# EAGLE design Martensino_1.0v (EAGLE 7.5.0)
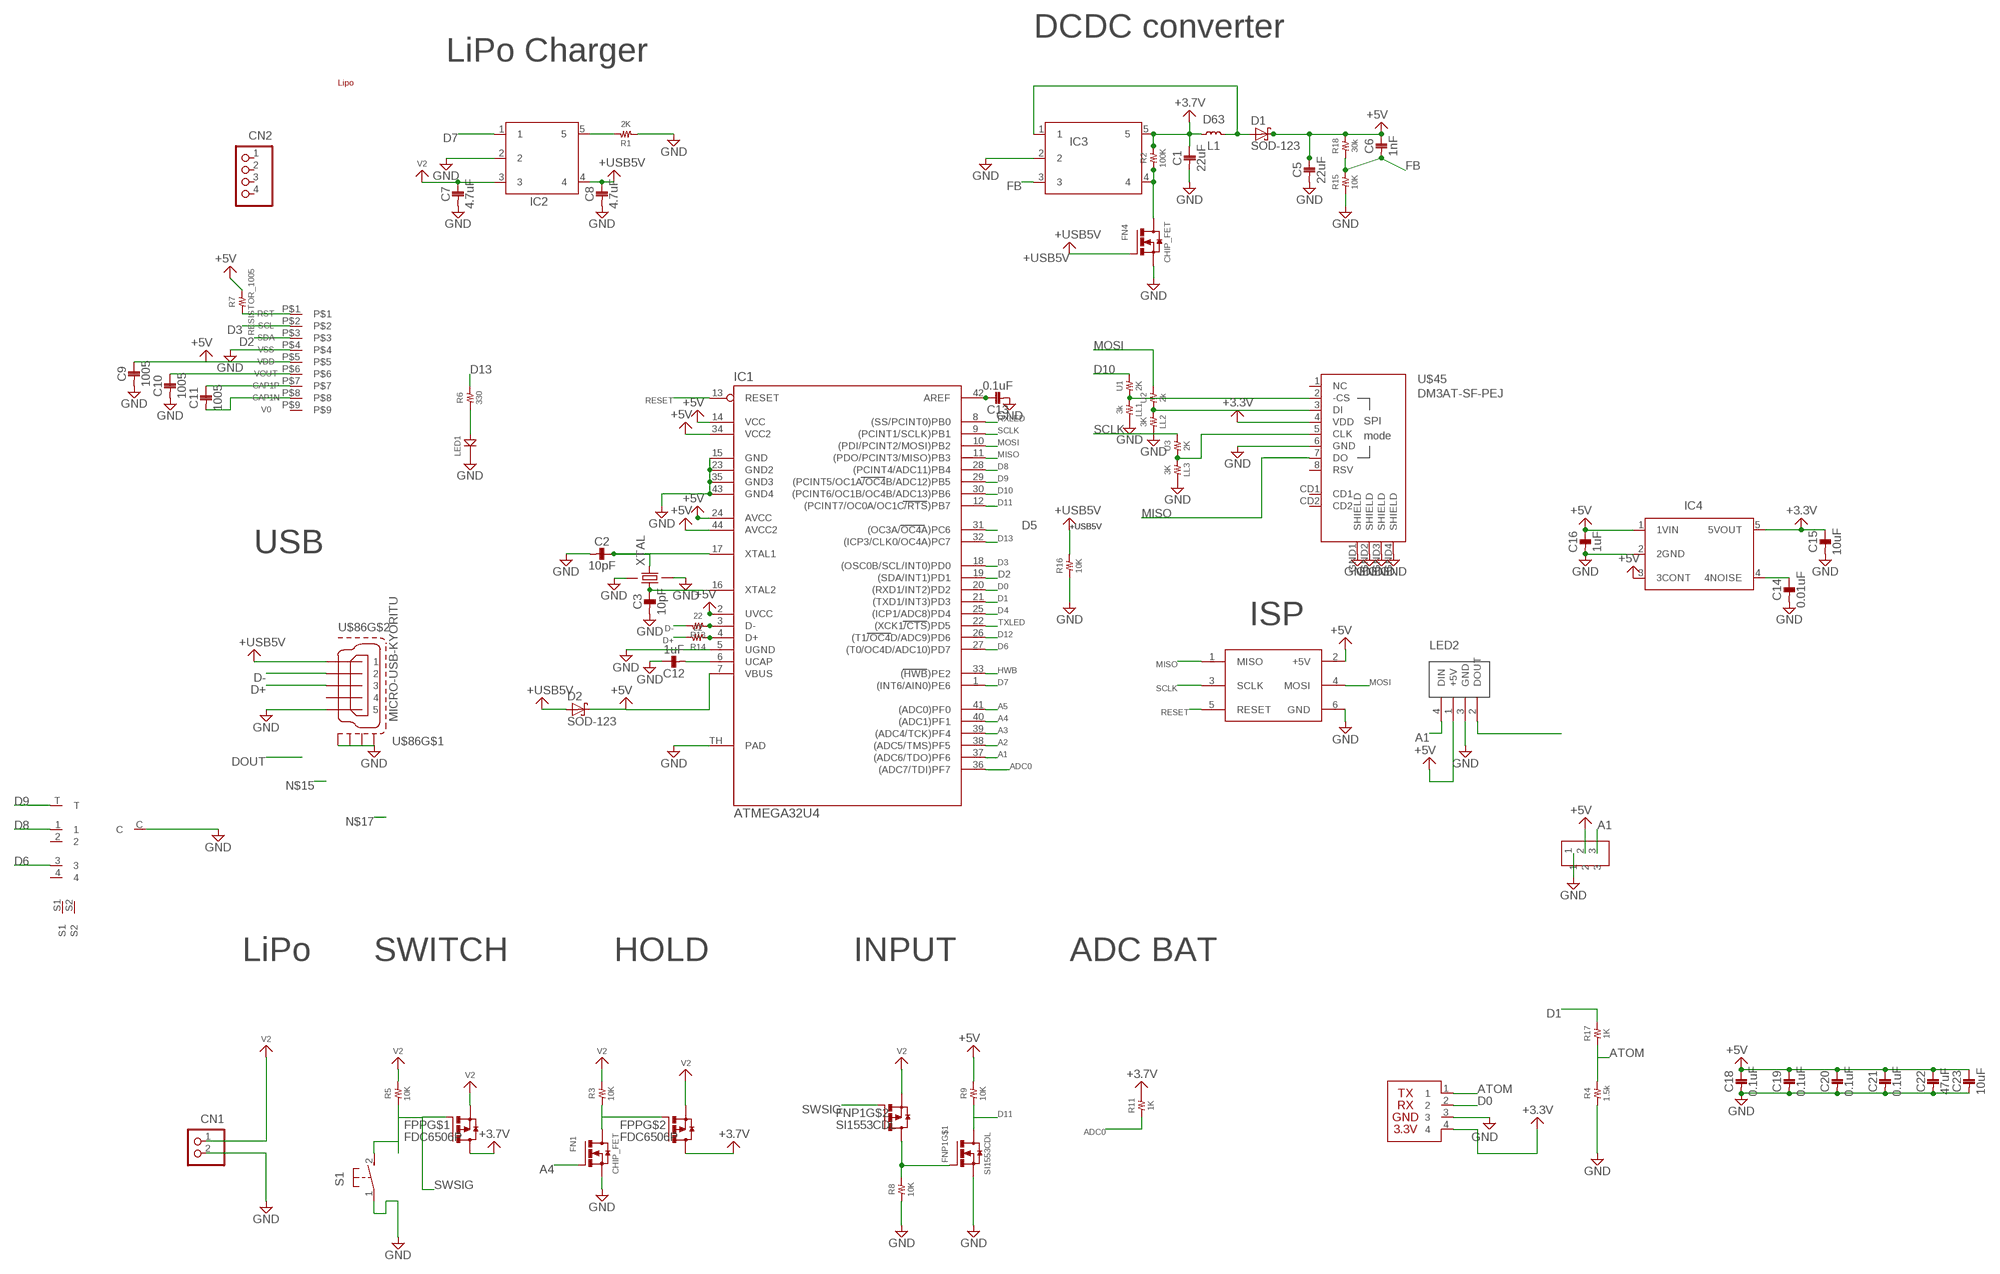
[diagram p0: schematic, sheet 1]

## Parts
BLE  BLE_SERIAL2_NO_HOLE  [BLESERIAL2_NO_HOLE]
C1  22uF  1608  [1608]
C2  10pF  1005  [1005]
C3  10pF  1005  [1005]
C5  22uF  1608  [1608]
C6  1nF  1005  [1005]
C7  4.7uF  1005  [1005]
C8  4.7uF  1005  [1005]
C9  1005  [1005]
C10  1005  [1005]
C11  1005  [1005]
C12  1uF  1005  [1005]
C13  0.1uF  1005  [1005]
C14  0.01uF  1608  [1608]
C15  10uF  1608  [1608]
C16  1uF  1005  [1005]
C18  0.1uF  1005  [1005]
C19  0.1uF  1005  [1005]
C20  0.1uF  1005  [1005]
C21  0.1uF  1005  [1005]
C22  47uF  1608  [1608]
C23  10uF  1608  [1608]
CN1  S2B-PH-K-S  [S2B-PH-K-S]
CN2  S4B-PH-K-S  [S4B-PH-K-S]
D1  SOD-123  [SOD_123]
D2  SOD-123  [SOD_123]
FN1  CHIP_FET  [SOT23]
FN4  CHIP_FET  [SOT23]
FNP1  SI1553CDL  [SOT363]
FPP  FDC6506P  [SOT23-6]
IC1  ATMEGA32U4  [QFN-44-7X7]
IC2  MCP73831  [SOT23-5L]
IC3  LM2735  [SOT23-5L]
IC4  TAR5SB  [SSOP5-P-0.95]
L1  D63  [TOKO]
LED1  CHIPLED  [1608]
LED2  NEO_FLAT  [NEO_FLAT]
LL1  3k  RESISTOR_1005  [1005]
LL2  3K  RESISTOR_1005  [1005]
LL3  3K  RESISTOR_1005  [1005]
R1  2K  RESISTOR_1005  [1005]
R2  100K  RESISTOR_1005  [1005]
R3  10K  RESISTOR_1005  [1005]
R4  1.5k  RESISTOR_1005  [1005]
R5  10K  RESISTOR_1005  [1005]
R6  330  RESISTOR_1005  [1005]
R7  RESISTOR_1005  [1005]
R8  10K  RESISTOR_1005  [1005]
R9  10K  RESISTOR_1005  [1005]
R11  1K  RESISTOR_1005  [1005]
R13  22  RESISTOR_1005  [1005]
R14  22  RESISTOR_1005  [1005]
R15  10K  RESISTOR_1005  [1005]
R16  10K  RESISTOR_1005  [1005]
R17  1K  RESISTOR_1005  [1005]
R18  30k  RESISTOR_1005  [1005]
S1  31-XX  [B3F-31XX]
U1  2K  RESISTOR_SMD_1005  [1005]
U2  2k  RESISTOR_SMD_1005  [1005]
U3  2K  RESISTOR_SMD_1005  [1005]
U$3  ICSP  [ICSP]
U$8  LIPO400MAH  [LIPO400MAH]
U$30  3PIN_HALF  [3PIN_INT_HALF]
U$45  DM3AT-SF-PEJ  [DM3AT-SF-PEJ]
U$68  LCD_I2C_AQM  [AQM1602]
U$86  MICRO-USB-KYORITU  [ZX62R-B-5P]
U$90  TMHU28  [TMHU28]
XTAL  FA-238  [FA-238]

## Nets
+3.3V: BLE.4 C15.P$1 IC4.5(5VOUT) U$45.4(VDD)
+3.7V: C1.P$1 FPP.4(D) FPP.6(D) IC3.5 L1.1 R2.2 R11.2
+5V: C5.P$1 C6.1 C9.1 C16.1 C18.1 C19.1 C20.1 C21.1 C22.P$1 C23.P$1 D1.C D2.C IC1.2(UVCC) IC1.7(VBUS) IC1.14(VCC) IC1.24(AVCC) IC1.34(VCC2) IC1.44(AVCC2) IC4.1(1VIN) IC4.3(3CONT) LED2.1(+5V) R7.2 R9.2 R18.2 U$3.2(+5V) U$30.2 U$68.P$5
+USB5V: C8.1 D2.A FN4.1(G) IC2.4 R16.2 U$86.5
A1: IC1.37((ADC6/TDO)PF6) LED2.4(DIN) U$30.3
A2: IC1.38((ADC5/TMS)PF5)
A3: IC1.39((ADC4/TCK)PF4)
A4: FN1.1(G) IC1.40((ADC1)PF1)
A5: IC1.41((ADC0)PF0)
ADC0: IC1.36((ADC7/TDI)PF7) R11.1
ATOM: BLE.1 R4.2 R17.1
D0: BLE.2 IC1.20((RXD1/INT2)PD2)
D1: IC1.21((TXD1/INT3)PD3) R17.2
D2: IC1.19((SDA/INT1)PD1) U$68.P$3
D3: IC1.18((OSC0B/SCL/INT0)PD0) U$68.P$2
D4: IC1.25((ICP1/ADC8)PD4)
D5: IC1.31((OC3A/OC4A)PC6)
D6: IC1.27((T0/OC4D/ADC10)PD7) U$90.3
D7: IC1.1((INT6/AIN0)PE6) IC2.1
D8: IC1.28((PCINT4/ADC11)PB4) U$90.1
D9: IC1.29((PCINT5/OC1A/OC4B/ADC12)PB5) U$90.T
D10: IC1.30((PCINT6/OC1B/OC4B/ADC13)PB6) U1.2
D11: FNP1.6(D) IC1.12((PCINT7/OC0A/OC1C/RTS)PB7) R9.1
D12: IC1.26((T1/OC4D/ADC9)PD6)
D13: IC1.32((ICP3/CLK0/OC4A)PC7) R6.2
D+: R14.2 U$86.3
D-: R13.2 U$86.4
DL: D1.A IC3.1 L1.2
DOUT: LED2.2(DOUT)
FB: C6.2 IC3.3 R15.2 R18.1
GND: BLE.3 C1.P$2 C2.2 C3.2 C5.P$2 C7.2 C8.2 C9.2 C10.2 C12.1 C13.2 C14.P$2 C15.P$2 C16.2 C18.2 C19.2 C20.2 C21.2 C22.P$2 C23.P$2 CN1.2 FN1.2(S) FN4.2(S) FNP1.1(S) IC1.5(UGND) IC1.15(GND) IC1.23(GND2) IC1.35(GND3) IC1.43(GND4) IC1.TH(PAD) IC2.2 IC3.2 IC4.2(2GND) LED1.2(K) LED2.3(GND) LL1.2 LL2.2 LL3.2 R1.1 R4.1 R8.1 R15.1 R16.1 S1.1(P) U$3.6(GND) U$30.1 U$45.6(GND) U$45.GND1(SHIELD) U$45.GND2(SHIELD) U$45.GND3(SHIELD) U$45.GND4(SHIELD) U$68.P$4 U$86.1 U$86.M1(S1) U$86.M2(S2) U$86.M3(S3) U$86.M4(S4) U$90.C XTAL.2 XTAL.4
HWB: IC1.33((HWB)PE2)
MISO: IC1.11((PDO/PCINT3/MISO)PB3) U$3.1(MISO) U$45.7(DO)
MOSI: IC1.10((PDI/PCINT2/MOSI)PB2) U2.2 U$3.4(MOSI)
N$1: LED1.1(A) R6.1
N$2: IC2.5 R1.2
N$3: FN4.3(D) IC3.4 R2.1
N$4: R7.1 U$68.P$1
N$5: LL3.1 U3.1 U$45.5(CLK)
N$6: FN1.3(D) FPP.3(G) R3.1
N$7: C3.1 IC1.16(XTAL2) XTAL.1
N$8: IC1.3(D-) R13.1
N$9: C13.1 IC1.42(AREF)
N$10: C2.1 IC1.17(XTAL1) XTAL.3
N$11: LL2.1 U2.1 U$45.3(DI)
N$12: LL1.1 U1.1 U$45.2(-CS)
N$13: C12.2 IC1.6(UCAP)
N$14: IC1.4(D+) R14.1
N$16: C14.P$1 IC4.4(4NOISE)
N$19: C10.1 U$68.P$6
N$20: C11.1 U$68.P$7
N$21: C11.2 U$68.P$8
RESET: IC1.13(RESET) U$3.5(RESET)
RXLED: IC1.8((SS/PCINT0)PB0)
SCLK: IC1.9((PCINT1/SCLK)PB1) U3.2 U$3.3(SCLK)
SIG: FNP1.2(G) FNP1.3(D) R8.2
SWSIG: FNP1.5(G) FPP.1(G) R5.1 S1.2(S)
TXLED: IC1.22((XCK1/CTS)PD5)
V2: C7.1 CN1.1 FNP1.4(S) FPP.2(S) FPP.5(S) IC2.3 R3.2 R5.2
Unconnected: CN2.1 CN2.2 CN2.3 CN2.4 U$45.1(NC) U$45.8(RSV) U$45.CD1 U$45.CD2 U$68.P$9 U$86.2 U$90.2 U$90.4 U$90.S1 U$90.S2

## Notes on the sheet
- DCDC converter
- LiPo Charger
- D5
- USB
- ISP
- LiPo | SWITCH | HOLD | INPUT | ADC BAT

## Library data of the parts
BLE = 12_module:BLE_SERIAL2_NO_HOLE
C1 C5 C14 C15 C22 C23 = 02_C:1608
C2 C3 C6-C13 C16 C18-C21 = 02_C:1005
CN1 = jst-ph1:S2B-PH-*: Wire-to-Board 2.0mm pitch side mount connector Source: http://www.jst-mfg.com/product/pdf/jpn/PH.pdf http://www.jst-mfg.com/product/detail.php?series=199
CN2 = jst-ph1:S4B-PH-*: Wire-to-Board 2.0mm pitch side mount connector Source: http://www.jst-mfg.com/product/pdf/jpn/PH.pdf http://www.jst-mfg.com/product/detail.php?series=199
D1 D2 = 15_DIODE:SOD-123
FN1 FN4 = 06_FET:CHIP_FET
FNP1 = 06_FET:SI1553CDL
FPP = 06_FET:FDC6506P
IC1 = 04_IC:ATMEGA32U4
IC2 = 04_IC:MCP73831
IC3 = 04_IC:LM2735
IC4 = 04_IC:TAR5SB
L1 = 03_L:D63
LED1 = 10_LED:CHIPLED
LED2 = 10_LED:NEO_FLAT
LL1-LL3 R1-R9 R11 R13-R18 = 01_R:RESISTOR_1005
S1 = 09_1_switch:31-XX: OMRON SWITCH
U1-U3 = 01_R:RESISTOR_SMD_1005
U$3 = 08_CONECTOR:ICSP
U$8 = 16_battery:LIPO400MAH
U$30 = 08_CONECTOR:3PIN_HALF
U$45 = sd-card:DM3AT-SF-PEJ: HIROSE microSD socket DM3AT-SF-PEJ
U$68 = 12_module:LCD_I2C_AQM
U$86 = con-hirose1:MICRO-USB-KYORITU
U$90 = 09_1_switch:TMHU28
XTAL = 09_2_CRYSTAL:FA-238

## Net classes
1 POWER: width 0.5 mm, clearance 0.5 mm

## Board
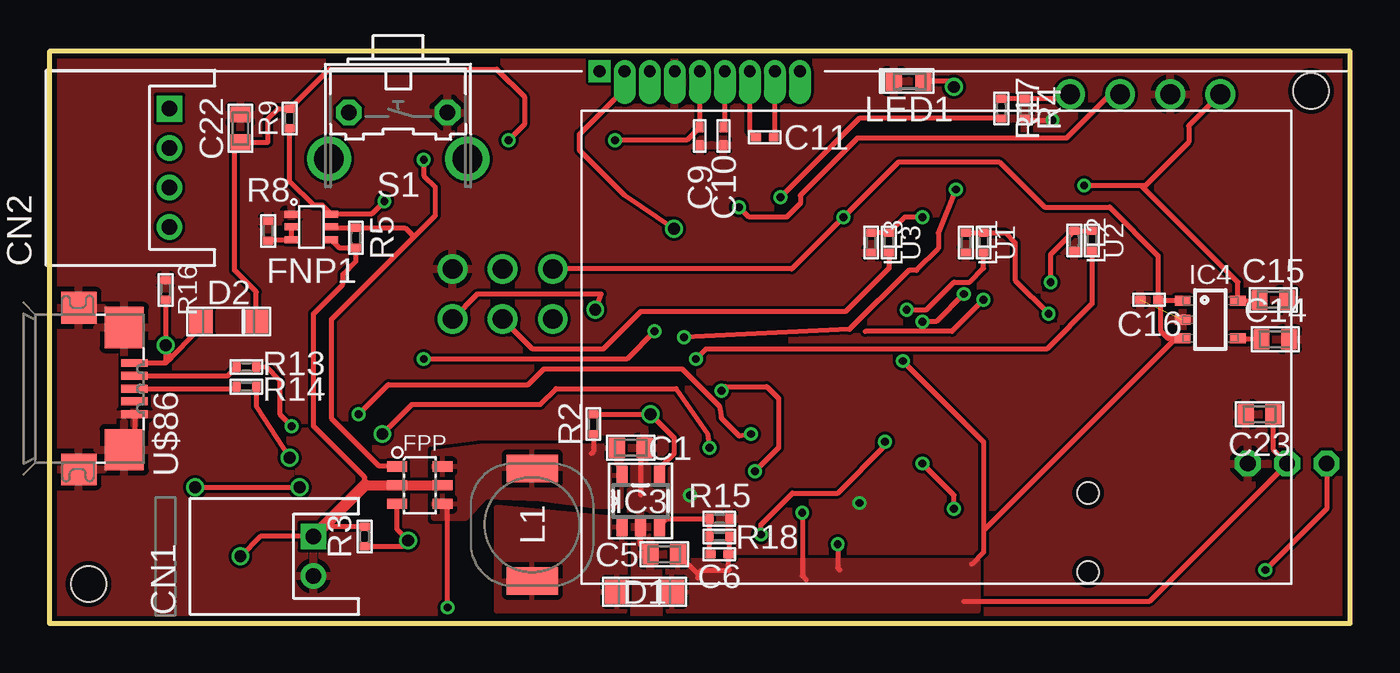
[diagram p1: board, top side]
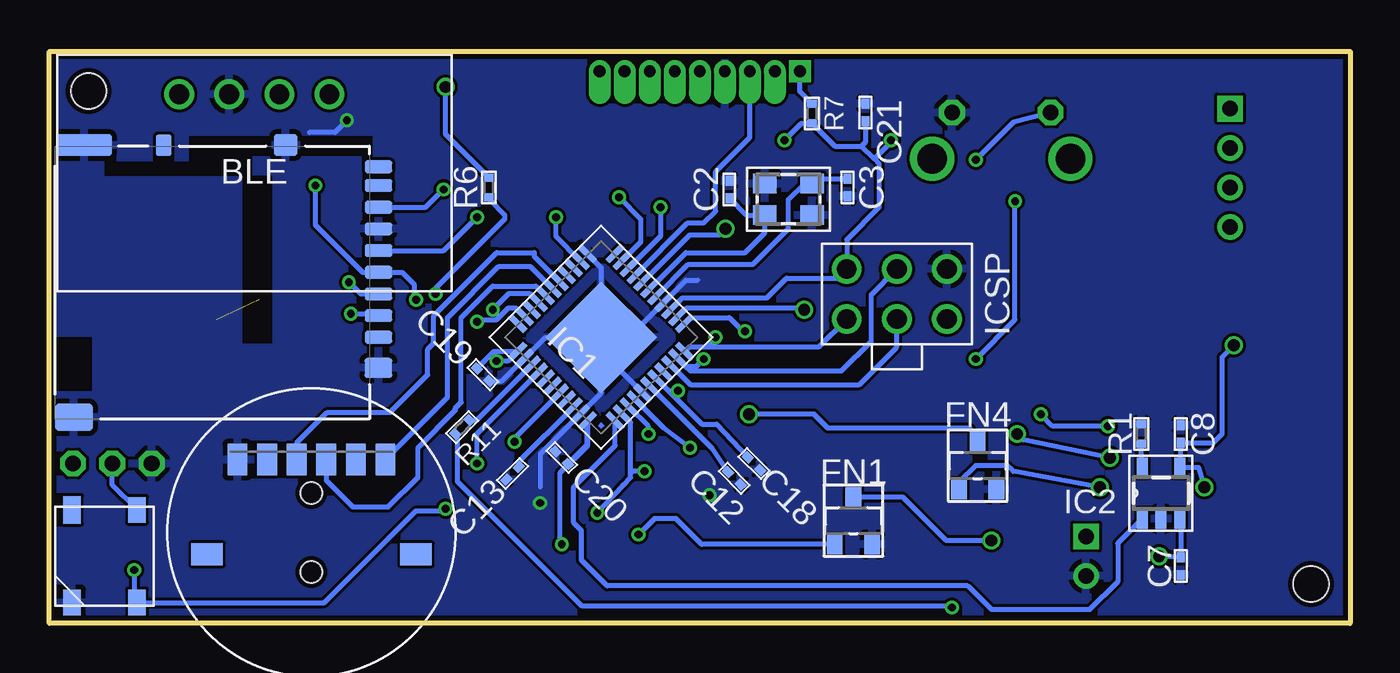
[diagram p2: board, bottom side, seen from below]

Size 66 x 29 mm. Coordinates in mm from the lower left corner, seen from the top.
Outline: 0,0 66,0 66,29 0,29 0,0
Copper layers (1*16): Top 0.035mm / dielectric 1.5mm / Bottom 0.035mm
Design rules "SeeedStudio_2layer_DRU_no_angle_20140221": minimum track width 6mil, minimum drill 12mil, track to track 6mil, track to pad 6mil, pad to pad 6mil, via to via 6mil, smd to smd 0mil, copper to edge 10mil, drill to drill 10mil, minimum pad ring 10mil, minimum via ring 6mil, stop-mask expansion 2mil, vias tented up to drill 100mil, thermal gap 10mil
Holes 1.8 mm at 2,2 64,27
bKeepout: area 62.5,25.5 to 65.5,28.5; area 0.5,0.5 to 3.5,3.5

### Footprints (pad centres in the part's own frame; a part is rotated, then mirrored left to right if it is on the bottom)
BLESERIAL2_NO_HOLE = drill 1: 1 -3.81,-2.73; 2 -1.27,-2.73; 3 1.27,-2.73; 4 3.81,-2.73
1608 = smd 0.8 x 1: P$1 -0.7,0; P$2 0.7,0
1005 = smd 0.5 x 0.4: 1 -0.45,0; 2 0.45,0
S2B-PH-K-S = drill 0.8 square: 1 1,0 | drill 0.8: 2 -1,0
S4B-PH-K-S = drill 0.8 square: 1 3,0 | drill 0.8: 2 1,0; 3 -1,0; 4 -3,0
SOD_123 = smd 1.2 x 1.2: A -1.4,0; C 1.4,0
SOT23 = smd 0.8 x 1: 1 -0.95,-1.2; 2 0.95,-1.2; 3 0,1.2
SOT363 = smd 0.35 x 0.7: 1 -0.65,-1; 2 0,-1; 3 0.65,-1; 4 0.65,1; 5 0,1; 6 -0.65,1
SOT23-6 = smd 0.508 x 1.016: 1 -0.95,-1.143; 2 0,-1.143; 3 0.95,-1.143; 4 0.95,1.143; 5 0,1.143; 6 -0.95,1.143
QFN-44-7X7 = smd 1.1 x 0.3: 1 -3.5,2.5; 2 -3.5,2; 3 -3.5,1.5; 4 -3.5,1; 5 -3.5,0.5; 6 -3.5,0; 7 -3.5,-0.5; 8 -3.5,-1; 9 -3.5,-1.5; 10 -3.5,-2; 11 -3.5,-2.5; 23 3.5,-2.5; 24 3.5,-2; 25 3.5,-1.5; 26 3.5,-1; 27 3.5,-0.5; 28 3.5,0; 29 3.5,0.5; 30 3.5,1; 31 3.5,1.5; 32 3.5,2; 33 3.5,2.5 | smd 0.3 x 1.1: 12 -2.5,-3.5; 13 -2,-3.5; 14 -1.5,-3.5; 15 -1,-3.5; 16 -0.5,-3.5; 17 0,-3.5; 18 0.5,-3.5; 19 1,-3.5; 20 1.5,-3.5; 21 2,-3.5; 22 2.5,-3.5; 34 2.5,3.5; 35 2,3.5; 36 1.5,3.5; 37 1,3.5; 38 0.5,3.5; 39 0,3.5; 40 -0.5,3.5; 41 -1,3.5; 42 -1.5,3.5; 43 -2,3.5; 44 -2.5,3.5 | smd 4 x 4: TH 0,0
SOT23-5L = smd 0.55 x 1: 1 -0.95,-1.3; 2 0,-1.3; 3 0.95,-1.3; 4 0.95,1.3; 5 -0.95,1.3
SSOP5-P-0.95 = smd 0.5 x 0.8: 1 -0.95,-1.4; 2 0,-1.4; 3 0.95,-1.4; 4 0.95,1.4; 5 -0.95,1.4
TOKO = smd 1.4 x 2.6: 1 -2.85,0; 2 2.85,0
1608' = smd 0.8 x 1: 1 -0.75,0; 2 0.75,0
NEO_FLAT = smd 1.3 x 0.9: 1 -2.35,1.65; 3 2.35,-1.65; 4 2.35,1.65 | smd 1.4 x 0.9: 2 -2.35,-1.65
1005' = smd 0.4 x 0.5: 1 -0.5,0; 2 0.5,0
B3F-31XX = drill 0.8 octagon: 1 -2.5,-1.1; 2 2.5,-1.1 | drill 1.5 pad 2.159: 3 -3.505,1.245; 4 3.505,1.245
ICSP = drill 1 pad 1.5: 1 -1.27,2.54; 2 1.27,2.54; 3 -1.27,0; 4 1.27,0; 5 -1.27,-2.54; 6 1.27,-2.54
3PIN_INT_HALF = drill 0.8 octagon: 1 -2,0; 2 0,0; 3 2,0
DM3AT-SF-PEJ = smd 0.65 x 1.4: 1 3.2,16.4; 2 2.1,16.4; 3 1,16.4; 4 -0.1,16.4; 5 -1.2,16.4; 6 -2.3,16.4; 7 -3.4,16.4; 8 -4.5,16.4; CD1 -5.45,16.4 | smd 1.1 x 0.8: CD2 -6.55,5.5 | smd 1.1 x 2.8: GND1 -6.55,1.475 | smd 1.4 x 1.9: GND2 7.25,0.95 | smd 1 x 1.4: GND3 4.75,16.4 | smd 1.1 x 1.2: GND4 -6.55,11.7
AQM1602 = drill 0.6 pad 0.813 square: P$1 -5.08,0 | drill 0.6 pad 0.813 offset: P$2 -3.81,0; P$3 -2.54,0; P$4 -1.27,0; P$5 0,0; P$6 1.27,0; P$7 2.54,0; P$8 3.81,0; P$9 5.08,0
ZX62R-B-5P = smd 1.35 x 0.4: 1 2.875,-1.3; 2 2.875,-0.65; 3 2.875,0; 4 2.875,0.65; 5 2.875,1.3 | smd 1.8 x 1.6: M1 0.05,-4.1; M2 0.05,4.1 | smd 2 x 2.1: M3 2.35,3.1; M4 2.35,-3.1
TMHU28 = smd 1 x 1.6: 1 -3.75,-3.7; 2 -2.25,-3.7; 3 0.75,-3.7; 4 2.25,-3.7; C 3.75,-3.7; T -0.75,-3.7 | smd 1.6 x 1.1: S1 -5.3,1.1; S2 5.3,1.1 | hole 1.1: 0,-2; 0,2
FA-238 = smd 1.2 x 1: 1 -1.2,-0.8; 2 1.2,-0.8; 3 1.2,0.8; 4 -1.2,0.8

### Placement (x,y rotation side)
BLE  55.6,24.1 180 bottom
C1  29.5,8.9 0 top
C2  31.5,22 90 bottom
C3  25.5,22.1 270 bottom
C5  31.2,3.5 180 top
C6  34,3.5 180 top
C7  8.6,2.9 270 bottom
C8  8.6,9.6 90 bottom
C9  33,24.7 270 top
C10  34.2,24.7 270 top
C11  36.3,24.65 0 top
C12  31.25,7.35 135 bottom
C13  42.5,7.6 225 bottom
C14  62.2,14.4 0 top
C15  62.1,16.4 0 top
C16  55.8,16.4 180 top
C18  30.25,8.1 315 bottom
C19  44,12.6 315 bottom
C20  40,8.4 135 bottom
C21  24.6,25.9 90 bottom
C22  9.7,25.1 90 top
C23  61.4,10.6 180 top
CN1  13.4,3.4 90 top
CN2  6.1,23.1 90 top
D1  30.2,1.6 0 top
D2  9.1,15.3 0 top
FN1  25.2,5.2 0 bottom
FN4  18.9,8 0 bottom
FNP1  13.3,20.1 270 top
FPP  18.8,7 270 top
IC1  38,14.5 135 bottom
IC2  9.6,6.6 0 bottom
IC3  30,6.2 0 top
IC4  58.9,15.4 270 top
L1  24.5,5 270 top
LED1  CHIPLED  [1608']  43.6,27.5 180 top
LED2  63.2,3.4 270 bottom
LL1  3k  [1005']  46.5,19.3 270 top
LL2  3K  [1005']  52,19.4 270 top
LL3  3K  [1005']  41.7,19.3 270 top
R1  2K  [1005']  10.6,9.6 270 bottom
R2  100K  [1005']  27.6,10.1 270 top
R3  10K  [1005']  16,4.4 90 top
R4  1.5k  [1005']  49.5,26.1 90 top
R5  10K  [1005']  15.55,19.55 270 top
R6  330  [1005']  43.7,22.1 270 bottom
R7  RESISTOR_1005  [1005']  27.3,25.85 270 bottom
R8  10K  [1005']  11.1,19.9 270 top
R9  10K  [1005']  12.2,25.6 90 top
R11  1K  [1005']  45.05,9.95 225 bottom
R13  22  [1005']  10,13 180 top
R14  22  [1005']  10,12 180 top
R15  10K  [1005']  34,5.3 180 top
R16  10K  [1005']  5.9,16.9 270 top
R17  1K  [1005']  48.3,26.1 270 top
R18  30k  [1005']  34,4.4 0 top
S1  17.7,24.8 180 top
U1  2K  [1005']  47.4,19.3 270 top
U2  2k  [1005']  52.9,19.4 270 top
U3  2K  [1005']  42.6,19.3 270 top
U$3  23,16.7 90 bottom
U$8  27,2 0 top
U$30  62.8,8.1 0 top
U$45  65.7,17.7 270 bottom
U$68  33,28 0 top
U$86  1.45,11.9 0 top
U$90  52.7,4.6 180 bottom
XTAL  28.5,21.5 180 bottom

### Tracks (layer width: path | path; a pad name or v marks a point on that pad's centre or on a via)
+3.3V  (via drill 0.4)
  Top 0.25: BLE.4 57.8,25.22 57.8,24.4 55.6,22.2 55.4,22.2 | 55.4,22.2 v52.5,22.2 | v47.4,16.4 45.8,14.8 41.4,14.8 | C15.P$1 61.35,16.35 IC4.5 60.3,17.3 55.4,22.2
  Bottom 0.25: v52.5,22.2 52.5,20.2 50.1,17.8 U$45.4 48.1,17.8 47.5,17.2 47.5,16.5 v47.4,16.4
+3.7V  (via drill 0.4)
  Top 0.25: R2.2 27.6,8.7 27.5,8.6 | v20.2,0.8 20.2,5.79 FPP.4
  Bottom 0.25: R11.2 45.3,9.49 45.3,7.2 39,0.9 20.3,0.9 v20.2,0.8
  pour Top: 29,9 29,5.9 27.8,5.9 24.9,6.3 22.1,6.4 21.1,5.3 19.5,5.3 19.5,8.7 21.9,9
+5V  (via drill 0.4)
  Top 0.25: U$68.P$5 C9.1 32.35,24.5 v28.7,24.5 | D2.C 10.5,16.8 9.4,17.9 9.4,24.1 C22.P$1 11.1,24.4 11.1,25.6 11.6,26.1 R9.2 14.2,28.1 22.7,28.1 24.1,26.7 24.1,25.3 v23.3,24.5 | R18.2 34.5,3.55 C6.1 34.45,2.75 34.5,2.7 33.1,2.7 32.9,2.5 | C5.P$1 32.9,2.5 | 32.9,2.5 32.9,2.3 | v38.2,5.6 38.2,2.4 38.4,2.2 | C23.P$1 62.1,8.8 U$30.2 55.8,1.1 46.4,1.1 | U$3.2 37.67,17.97 v40.3,20.6 43.1,23.4 48.2,23.4 50.5,21.1 53.8,21.1 56.25,18.65 C16.1 | v43.3,13.3 47.4,9.2 47.4,4.7 | 47.4,4.7 47.4,3.6 46.8,3 | v40,4 40,2.8 40.1,2.7 | v34.1,11.8 34.3,12 36.4,12 37,11.4 37,8.9 v35.8,7.7 | IC4.1 56.3,16.35 C16.1 | C16.1 56.4,16.25 56.4,14.8 56.75,14.45 IC4.3 57.15,14.45 47.4,4.7
  Bottom 0.25: 24.8,24.2 26.15,24.2 R7.2 27.85,25.35 v28.7,24.5 | 24.8,24.2 24.15,23.55 | 24.15,23.55 23.9,23.3 23.9,21.1 25.54,19.46 U$3.2 26.01,17.5 28.6,17.5 29.6,16.5 33.88,16.5 IC1.14 | C18.1 32.15,10.1 32.89,10.1 IC1.7 34.59,11.8 v34.1,11.8 | C19.1 43.44,13.79 IC1.34 42.74,13.3 v43.3,13.3 | C21.1 24.6,24.4 24.8,24.2 | 36.5,7.6 36.5,7.4 36.9,7 v38.2,5.6 | 36.5,7.6 36.5,10.17 IC1.2 | C20.1 38.71,9.06 IC1.44 38.7,9 40.1,7.6 40.1,4.1 v40,4 | v23.3,24.5 23.3,24.4 24.15,23.55 | LED2.1 62.8,7 U$30.2 | IC1.24 40.3,19.63 v40.3,20.6 | v35.8,7.7 36.4,7.7 36.5,7.6
  pour Top: 31.4,0.6 31.4,3.2 47.1,3.2 47.1,0.6
+USB5V  (via drill 0.6)
  Top 0.25: U$86.5 5.8,13.2 | 5.8,13.2 5.9,13.2 6.2,13.5 | 6.2,13.5 7.4,14.7 7.4,15 D2.A | v5.9,14.1 5.9,13.3 5.8,13.2 | R16.2 5.9,13.8 6.2,13.5 | v7.4,6.9 v12.7,6.9
  Bottom 0.25: v5.9,14.1 6.5,13.5 6.5,9.6 6.95,9.15 C8.1 8.6,7.95 IC2.4 7.7,7.9 v7.4,6.9 | FN4.1 19.85,7.15 19,8 17.4,8 17.1,7.7 v12.7,6.9
A1  (via drill 0.4)
  Top 0.25: v45.9,5.8 45.9,6.5 v44.3,8.1 | U$30.3 64.8,5.8 v61.7,2.7
  Bottom 0.25: v45.9,5.8 46,5.7 47.4,5.7 52.05,1.05 LED2.4 61.7,1.2 v61.7,2.7 | v44.3,8.1 44.3,9.61 IC1.37
A4  (via drill 0.4)
  Top 0.25: v36.1,4.5 36.1,5 37.7,6.6 40,6.6 42.4,9 v42.4,9.2
  Bottom 0.25: FN1.1 32.9,4 34.2,5.3 35.3,5.3 v36.1,4.5 | v42.4,9.2 42.4,9.39 IC1.40
ADC0
  Bottom 0.25: R11.1 44.32,10.3 IC1.36
ATOM
  Top 0.25: BLE.1 51.56,26.6 R4.2 R17.1
D0  (via drill 0.4)
  Top 0.25: BLE.2 53.83,26.83 51.6,24.6 41,24.6 38.1,21.7 38.1,21.3 37.4,20.6 35.5,20.6 v35,21.1
  Bottom 0.25: v35,21.1 35,19.62 IC1.20
D1  (via drill 0.4)
  Top 0.25: R17.2 41.1,25.6 v37.1,21.6
  Bottom 0.25: v37.1,21.6 36,20.5 36,19.33 IC1.21
D2
  Bottom 0.25: U$68.P$3 30.46,24.64 32.2,22.9 32.2,20.9 32.8,20.3 33.61,20.3 IC1.19
D3  (via drill 0.6)
  Top 0.25: v31.7,20 29.19,21.71 26.9,24 26.9,24.8 29.19,27.09 U$68.P$2
  Bottom 0.25: IC1.18 33.51,19.7 32,19.7 v31.7,20
D6
  Bottom 0.25: U$90.3 53.45,9.15 51.9,10.7 48.7,10.7 46.8,12.6 46.8,13.9 46.5,14.2 46.5,15.6 43.3,18.8 41.4,18.8 41.4,18.61 IC1.27
D7
  Bottom 0.25: IC2.1 11.8,4.05 11.8,2.1 13.2,0.7 18.2,0.7 19.4,1.9 37.7,1.9 39,3.2 39,4.7 39.4,5.1 39.4,6.9 37.29,9.01 IC1.1
D8
  Bottom 0.25: U$90.1 45.8,11.45 45.8,15.5 43.2,18.1 41.6,18.1 IC1.28
D9
  Bottom 0.25: U$90.T 51.95,7.25 50.6,5.9 48.8,5.9 47.3,7.4 47.3,8.9 45.4,10.8 45.4,10.9 45.1,11.2 45.1,15.5 43.5,17.1 41.31,17.1 IC1.29
D10  (via drill 0.4)
  Top 0.25: v43.5,15.9 44.5,15.9 45.9,17.3 46.7,17.3 47.4,18 U1.2
  Bottom 0.25: IC1.30 41.61,16.7 42.7,16.7 v43.5,15.9
D11  (via drill 0.4)
  Top 0.25: R9.1 12.2,22.4 13.4,21.2 13.85,21.2 FNP1.6 16.35,20.75 v17,21.4 | v30.7,14.8 29.3,13.4 v19,13.4
  Bottom 0.25: IC1.12 33.46,15.5 31.5,15.5 30.8,14.8 v30.7,14.8 | v19,13.4 17,15.4 v17,21.4
D13  (via drill 0.4)
  Top 0.25: v46.4,16.7 45,15.3 v44.3,15.3
  Bottom 0.25: R6.2 43.7,21.5 42.9,20.7 42.9,20.5 46.4,17 v46.4,16.7 | v44.3,15.3 44.2,15.4 43.3,15.4 42.7,16 42.33,16 IC1.32
D+
  Top 0.25: U$86.3 9.4,11.9 R14.2
D-
  Top 0.25: U$86.4 9.05,12.55 R13.2
DL
  pour Top (rank 3): 22.7,0.6 22.7,5.9 29.2,5.3 29.2,0.6
FB
  Top 0.25: C6.2 33.5,3.55 R18.1 R15.2 31.35,5.3 IC3.3
GND  (via drill 0.4)  (1 unrouted)
  Top 0.25: U$86.1 4.33,9.32 U$86.M4 | C5.P$2 30,4 IC3.2 | C1.P$2 30,8.7 30,6.5 | R4.1 49.6,25.5 v50.9,25.5
  Bottom 0.25: IC1.TH 36.59,14.5 36.59,14.51 34.82,16.28 | IC1.5 38,13.79 IC1.TH | IC1.TH 38,11.67 IC1.43 41.1,8.57 41.1,6.9 | IC1.TH 40.83,14.5 IC1.35 43.05,12.28 C19.2 | IC1.23 38,18.04 IC1.TH | 33.1,17.4 33.7,17.4 34.82,16.28 | IC1.15 34.82,16.28 | v50.9,25.5 51.5,24.9 52.8,24.9
  other vias: 32.5,6.5 41.1,6.1
  pour Bottom (rank 6): -10,34 70,34 70,-5 -10,-5
  pour Top (rank 6): -10,30 70,30 70,-5 -10,-5
MISO  (via drill 0.4)
  Top 0.25: v46,22 45.1,19.8 45.1,19 44,17.9 43.6,17.9 40.6,14.9 v32.2,14.5
  Bottom 0.25: U$3.1 26.97,14 32.6,14 | 32.6,14 33.55,14 IC1.11 | v32.2,14.5 32.2,14.4 32.6,14 | U$45.7 46.9,21.1 v46,22
MOSI  (via drill 0.4)
  Top 0.25: v32.8,13.4 33.3,13.9 50.6,13.9 52.9,16.2 U2.2
  Bottom 0.25: IC1.10 33.69,13.01 | 33.69,13.01 33.47,12.8 25.8,12.8 24.3,14.3 24.3,16.67 U$3.4 | v32.8,13.4 33.19,13.01 33.69,13.01
N$1  (via drill 0.6)
  Top 0.25: v45.9,27.2 45.6,27.5 LED1.1
  Bottom 0.25: R6.1 45.9,24.8 v45.9,27.2
N$2
  Bottom 0.25: IC2.5 10.6,7.95 R1.2
N$3  (via drill 0.6)
  Top 0.25: IC3.4 30.95,7.85 31.7,8.6 31.7,9.4 v30.5,10.6 R2.1
  Bottom 0.25: FN4.3 19.3,9.9 26.5,9.9 27.2,10.6 v30.5,10.6
N$4
  Bottom 0.25: R7.1 27.92,26.97 U$68.P$1
N$5  (via drill 0.4)
  Top 0.25: v44.3,20.6 43.4,20.6 U3.1 LL3.1
  Bottom 0.25: v44.3,20.6 46,18.9 U$45.5
N$6  (via drill 0.6)
  Top 0.25: FPP.3 17.66,4.74 v18.2,4.2 17.9,3.9 R3.1
  Bottom 0.25: v18.2,4.2 20.5,4.2 22.7,6.4 FN1.3
N$7
  Bottom 0.25: C3.1 27.05,22.55 XTAL.1 27.7,22.3 28.5,21.5 28.5,20 30.3,18.2 33.59,18.2 IC1.16
N$8  (via drill 0.4)
  Top 0.25: R13.1 11,13 11.7,12.3 11.7,10.6 v12.3,10 | v15.7,10.6 17.2,12.1 24.3,12.1 25.1,12.9 32.1,12.9 34,11 34.1,10.4 35,9.5 v35.6,9.6
  Bottom 0.25: v12.3,10 15.1,10 v15.7,10.6 | v35.6,9.6 35.6,9.98 IC1.3
N$9
  Bottom 0.25: C13.1 42.18,8.2 IC1.42
N$10
  Bottom 0.25: C2.1 30.65,20.7 XTAL.3 29.7,19.8 30.7,18.8 33.7,18.8 IC1.17
N$11  (via drill 0.4)
  Top 0.25: v50.8,17.3 50.8,18.7 LL2.1 U2.1
  Bottom 0.25: v50.8,17.3 50.2,16.7 U$45.3
N$12  (via drill 0.4)
  Top 0.25: v50.7,15.7 49,17.4 49,19.3 48.5,19.8 U1.1 LL1.1
  Bottom 0.25: v50.7,15.7 49.4,15.7 U$45.2
N$13
  Bottom 0.25: IC1.6 32.7,9.2 | 32.7,9.2 | 32.7,9.2 32.37,8.87 C12.2
N$14  (via drill 0.4, 0.6)
  Top 0.25: R14.1 10.5,11 v12.2,8.4 | v16.9,9.6 18.4,11.1 24.9,11.1 25.7,11.9 31.8,11.9 33.4,9.6 v33.5,8.9
  Bottom 0.25: v12.2,8.4 16.6,9.3 v16.9,9.6 | v33.5,8.9 34.81,9.9 IC1.4
N$16
  Top 0.25: C14.P$1 60.3,14.4 IC4.4
N$19
  Top 0.25: C10.1 34.27,25.22 U$68.P$6
N$20
  Top 0.25: C11.1 35.54,24.96 U$68.P$7
N$21
  Top 0.25: C11.2 36.81,24.71 U$68.P$8
RESET  (via drill 0.6)
  Top 0.25: U$3.5 21.73,16.7 28,16.7 v27.7,15.9
  Bottom 0.25: IC1.13 33.67,16 27.8,16 v27.7,15.9
SCLK
  Top 0.25: U3.2 42.6,18 40.4,15.8 30,15.8 28.1,13.9 24.53,13.9 U$3.3
  Bottom 0.25: IC1.9 33.48,12.1 24.9,12.1 23,14 U$3.3
SIG
  Top 0.25: R8.2 11.15,19.45 FNP1.3 FNP1.2
SWSIG  (via drill 0.4)
  Top 0.25: 18.5,19.6 14.3,15.4 14.3,10.4 16.7,8 17.61,8 FPP.1 | 18.5,19.6 19.57,20.68 19.57,22.12 19,22.7 v19,23.5 | FNP1.5 14.35,20.05 R5.1 18.05,20.05 18.5,19.6
  Bottom 0.25: S1.2 17.1,25.4 v19,23.5
V2  (via drill 0.6)
  Top 0.25: v9.7,3.4 10.7,4.4 CN1.1 arc-90 13.9,4.9 R3.2 | FNP1.4 14.7,19.05 R5.2 15.55,18.35 14.9,17.7 14.9,17.2 13.4,15.7 13.4,10 16,7.4 16,7
  Top 0.5: 16,7 FPP.2 FPP.5
  Top 0.6: CN1.1 16,7
  Bottom 0.25: IC2.3 8.6,5.25 C7.1 9.25,3.4 v9.7,3.4

### Text on the board
_bPlace: L1
_tNames: C12 | R1 | FN4 | R2 | R13 | IC2 | R14 | C7 | C8 | LED1 | SW2 | R8 | C14 | C16 | C15 | R5 | IC4 | FNP1 | D2 | R17 | R16
_bNames: D1 | C6 | CN1 | C19 | C5 | R18 | C13 | IC3 | R15 | R11 | C23 | FPP | C1 | R3 | IC1 | R6 | C20 | FN1 | C22 | C21 | BLE | R9 | C2 | C3 | C18 | R4